# Altium schematic sheet Power.SchDoc: Наименование
size 209 x 297 mm; ApprovedBy: Утвердил; CheckedBy: Проверил; Author: Разработал; CompanyName: Организация; DrawnBy: Н.Контр; Engineer: Т.Контр; SheetNumber: 2; SheetTotal: 5; PageSetup: Record=PageOptions|CenterHorizontal=True|CenterVertical=True|PrintScale=0.94|XCorrection=1.00|YCorrection=1.00|PrintKind=1|BorderSize=5000000|LeftOffset=0|BottomOffset=0|Orientation=1|PaperLength=1000|PaperWidth=1000|Scale=100|PaperSource=7|PrintQuality=-4|MediaType=1|DitherType=10|PaperKind=A4|PrintScaleMode=1; DecimalNumber: Децимальный номер; HeadOfSector: Нач. сектора; MainDevice: Перв.примен.; Name: Наименование; DocumentName: Sheet1.SCHDOC
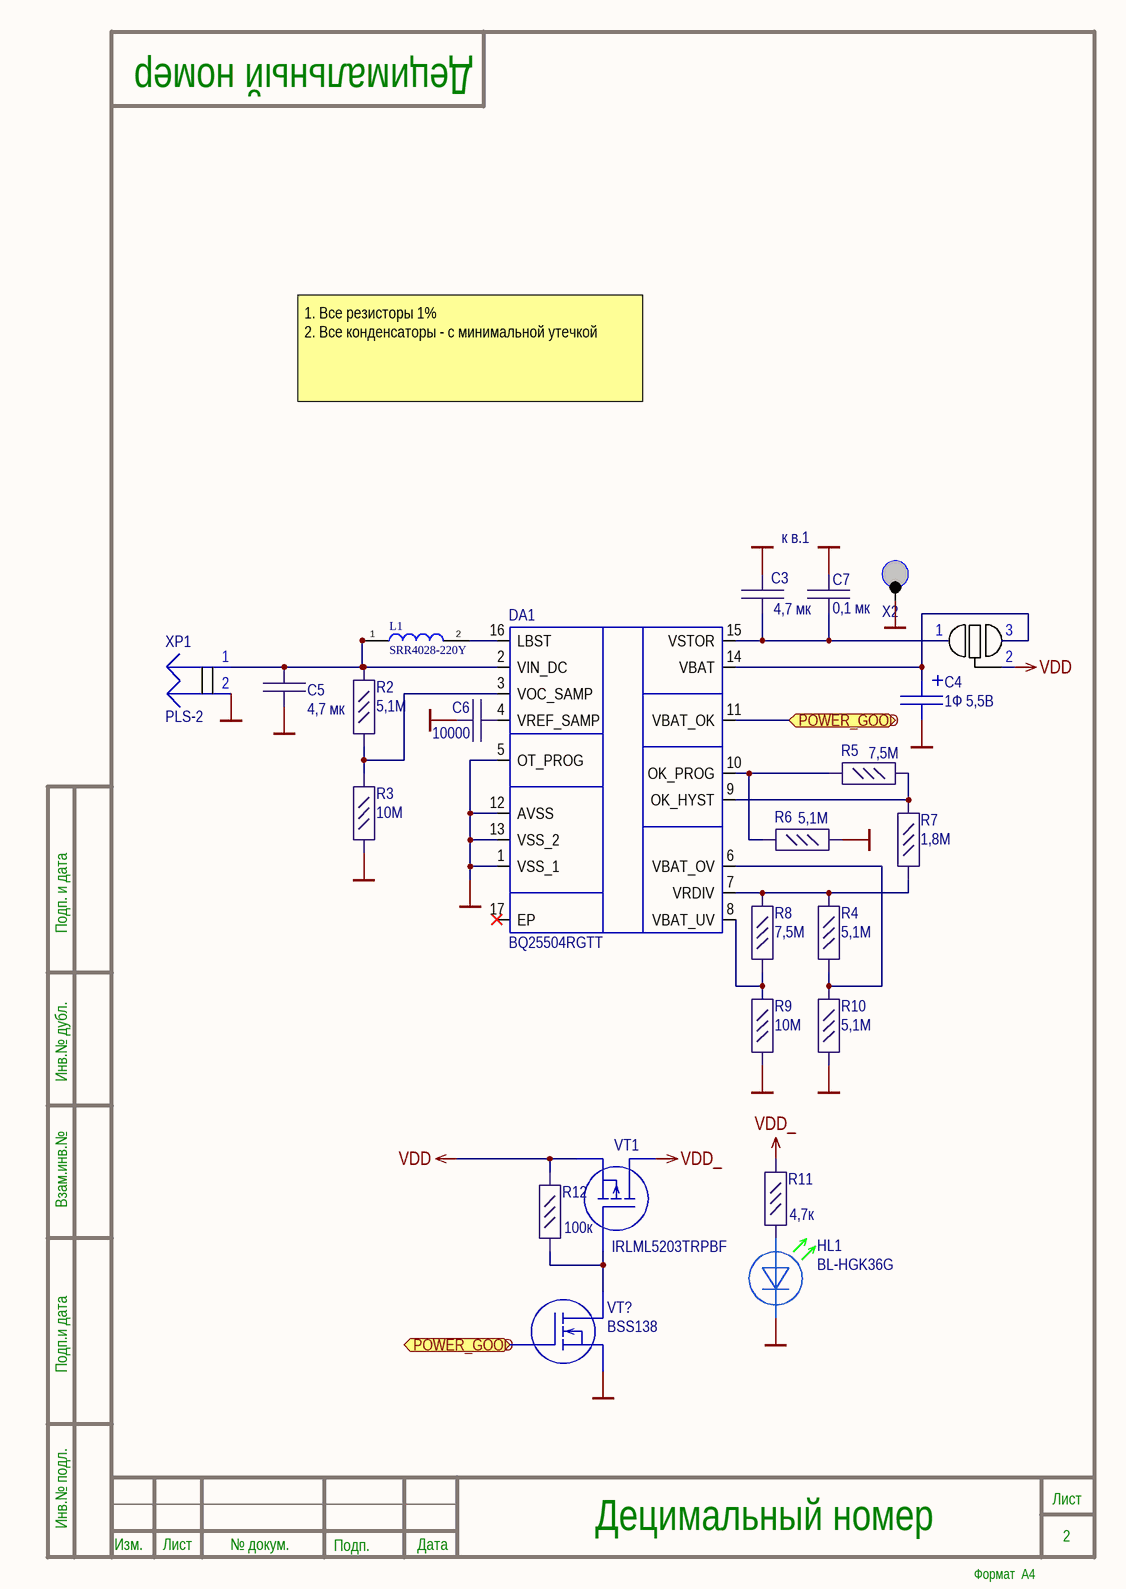
[diagram p0: Power.SchDoc]

## Parts
C3  4,7 мк  [C_0603]
C4  1Ф 5,5В  [EECF5R5u]
C5  4,7 мк  [C_0603]
C6  10000  [C_0603]
C7  0,1 мк  [C_0603]
DA1  BQ25504RGTT  [VQFN-16]
HL1  BL-HGK36G  [LED_0603_GREEN]
L1  SRR4028-220Y  [SRR4028220Y]
R2  5,1М  [R_0603]
R3  10М  [R_0603]
R4  5,1M  [R_0603]
R5  7,5М  [R_0603]
R6  5,1M  [R_0603]
R7  1,8М  [R_0603]
R8  7,5M  [R_0603]
R9  10M  [R_0603]
R10  5,1M  [R_0603]
R11  4,7к  [R_0603]
R12  100к  [R_0603]
VT1  IRLML5203TRPBF  [SOT23]
VT?  BSS138  [SOT23]
X2  КТ  [KT_2]  (value not drawn)
X4  Solder_jumper_3  [Solder_jumper_3]  (value not drawn)
XP1  PLS-2  [PLS-2]

## Ports
POWER_GOOD (bidir)

## Nets
GND: C3.1 C4.2 C5.1 C6.2 C7.2 DA1.1(VSS_1) DA1.5(OT_PROG) DA1.12(AVSS) DA1.13(VSS_2) HL1.2 R3.1 R6.2 R9.2 R10.2 VT?.2(S) X2.1 XP1.2
VDD: R12.1 VT1.2(S) X4.2
VDD_: R11.1 VT1.3(D)
POWER_GOOD: DA1.11(VBAT_OK) VT?.1(G) ; port POWER_GOOD
NetC3_2: C3.2 C7.1 DA1.15(VSTOR) X4.1
NetC4_1: C4.1 DA1.14(VBAT) X4.3
NetC5_2: C5.2 DA1.2(VIN_DC) L1.1 R2.2 XP1.1
NetC6_1: C6.1 DA1.4(VREF_SAMP)
NetDA1_3: DA1.3(VOC_SAMP) R2.1 R3.2
NetDA1_6: DA1.6(VBAT_OV) R4.2 R10.1
NetDA1_7: DA1.7(VRDIV) R4.1 R7.2 R8.1
NetDA1_8: DA1.8(VBAT_UV) R8.2 R9.1
NetDA1_9: DA1.9(OK_HYST) R5.2 R7.1
NetDA1_10: DA1.10(OK_PROG) R5.1 R6.1
NetDA1_16: DA1.16(LBST) L1.2
NetHL1_1: HL1.1 R11.2
NetR12_2: R12.2 VT1.1(G) VT?.3(D)

Not connected (* = marked no-connect by the designer): DA1 17(EP)*

## Notes on the sheet
- 1. Все резисторы 1%
  2. Все конденсаторы - с минимальной утечкой
- к в.1
- Подп. и дата
- Инв.№ дубл.
- Взам.инв.№
- Подп.и дата
- Инв.№ подл.
- Изм.
- Лист
- № докум.
- Подп.
- Дата
- Формат  A4

## Library data of the parts
C3 C5 = GRM185C81A475KE11D: CAP CER 4.7UF 10V X6S 0603; Manufacturer: Murata Electronics; Value: 4.7µF; Part Number: GRM185C81A475KE11D; ComponentLink1URL: https://search.murata.co.jp/Ceramy/image/img/A01X/G101/ENG/GRM185C81A475KE11-01.pdf; ComponentLink1Description: Datasheet; Component Type: Capasitor
C4 = EECF5R5U105: 1 Ф, 5.5 В, 5 мм, 2208H, Ионистор
C6 = GRM1857U1A103JA44D: CAP CER 10000PF 10V U2J 0603; Manufacturer: Murata Electronics; Part Number: GRM1857U1A103JA44D; Value: 10000pF; ComponentLink1URL: https://www.murata.com/~/media/webrenewal/support/library/catalog/products/capacitor/mlcc/c02e.ashx?la=en-us; ComponentLink1Description: Datasheet; Component Type: Capasitor
C7 = GRM188R72A104MA35D: CAP CER 0.1UF 100V X7R 0603; Manufacturer: Murata Electronics; Value: 0.1µF; Part Number: GRM188R72A104MA35D; ComponentLink1URL: https://search.murata.co.jp/Ceramy/image/img/A01X/G101/ENG/GRM188R72A104MA35-01.pdf; ComponentLink1Description: Datasheet; Component Type: Capasitor
DA1 = BQ25504RGTT: Ultra Low-Power Boost Converter With Battery Management For Energy Harvester Applications; Manufacturer_Name: Texas Instruments; Datasheet Link: http://www.ti.com/general/docs/lit/getliterature.tsp?genericPartNumber=BQ25504&&fileType=pdf; Height: 1mm; Manufacturer_Part_Number: BQ25504RGTT; Mouser Part Number: 595-BQ25504RGTT; Mouser Price/Stock: https://www.mouser.co.uk/ProductDetail/Texas-Instruments/BQ25504RGTT?qs=LDM2r2BBpnbezhyy8cKCSA%3D%3D; Arrow Part Number: BQ25504RGTT; Arrow Price/Stock: https://www.arrow.com/en/products/bq25504rgtt/texas-instruments?region=nac
HL1 = BL-HGK36G: SMD LED 0603 TOP зеленый
L1 = SRR4028-220Y: Inductor; Manufacturer_Name: Bourns; Datasheet Link: https://componentsearchengine.com/Datasheets/2/SRR4028-220Y.pdf; Height: 3mm; Manufacturer_Part_Number: SRR4028-220Y; Mouser Part Number: 652-SRR4028-220Y; Mouser Price/Stock: https://www.mouser.co.uk/ProductDetail/Bourns/SRR4028-220Y?qs=s%252BX%2FYkvGCpHgCkRmGbimqg%3D%3D; Arrow Part Number: SRR4028-220Y; Arrow Price/Stock: https://www.arrow.com/en/products/srr4028-220y/bourns
R2 R3 = CR0603-FX-4994ELF: RES SMD 4.99M OHM 1% 1/10W 0603; Manufacturer: Bourns Inc.; Value: 4,99 M; Part Number: CR0603-FX-4994ELF; ComponentLink1URL: https://www.bourns.com/pdfs/chpreztr.pdf; ComponentLink1Description: Datasheet; Component Type: Resistor
R4-R12 = CR0603-FX-3094ELF: RES SMD 3.09M OHM 1% 1/10W 0603; Manufacturer: Bourns Inc.; Value: 3,09 M; Part Number: CR0603-FX-3094ELF; ComponentLink1URL: https://www.bourns.com/pdfs/chpreztr.pdf; ComponentLink1Description: Datasheet; Component Type: Resistor
VT1 = IRLML5203TRPBF: Транзистор, P-канал 30В 3A logic
VT? = BSS138: MOSFET, N-канал, 0.2А, 50В